# Altium schematic sheet OZ440-SE100-CAR003_sheet15.SchDoc
size A3
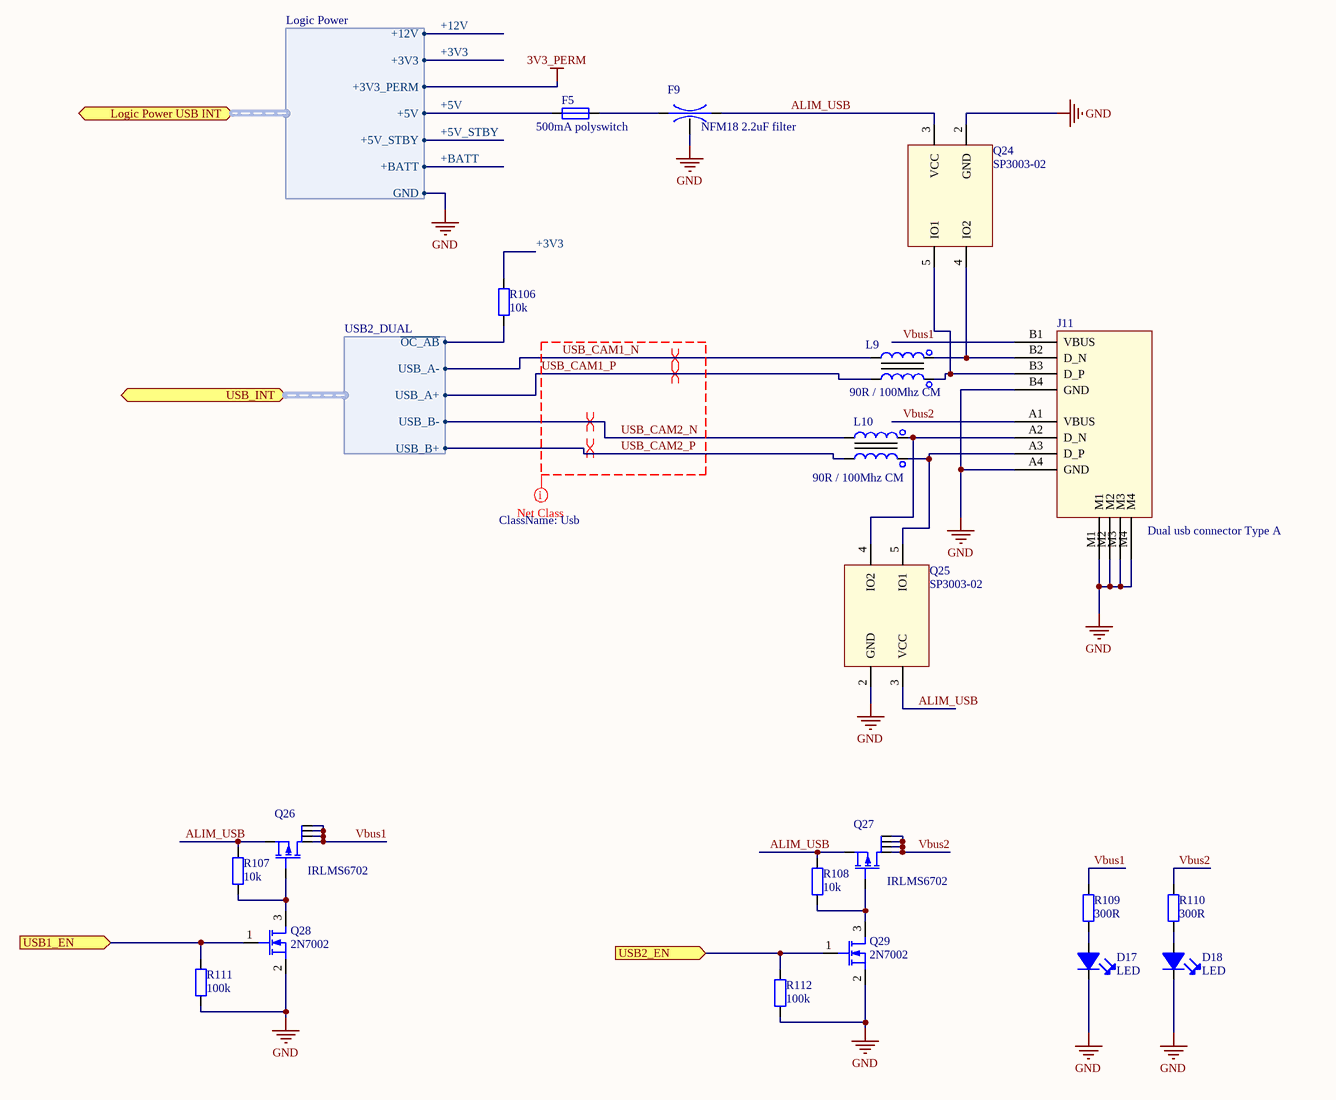
[diagram p0: OZ440-SE100-CAR003_sheet15.SchDoc]

## Parts
D17  LED  [0603-SPE-LED]
D18  LED  [0603-SPE-LED]
F5  Displayed reference: 500mA polyswitch  [R0805-STD]  (hidden comment: FUSE-SMD)
F9  Displayed reference: NFM18 2.2uF filter  [LC_0603-STD]  (hidden comment: LC_FILTER-STD)
J11  Displayed reference: Dual usb connector Type A  [CONN-STD-USB_A]  (hidden comment: CONN-STD_USB_A_DUAL)
L9  Displayed reference: 90R / 100Mhz CM  [L-SPE-0805_MC_EXC34]  (hidden comment: IND-MC-SMD)
L10  Displayed reference: 90R / 100Mhz CM  [L-SPE-0805_MC_EXC34]  (hidden comment: IND-MC-SMD)
Q24  Displayed reference: SP3003-02  [SC70-SPE-SP3003]  (hidden comment: SP03003_02-SC70)
Q25  Displayed reference: SP3003-02  [SC70-SPE-SP3003]  (hidden comment: SP03003_02-SC70)
Q26  Displayed reference: IRLMS6702  [MICRO6-SPE-IRLMS6702]  (hidden comment: IRLMS6702-MICRO6)
Q27  Displayed reference: IRLMS6702  [MICRO6-SPE-IRLMS6702]  (hidden comment: IRLMS6702-MICRO6)
Q28  Displayed reference: 2N7002  [SOT23-SPE-2N7002]  (hidden comment: 2N7002-SMD3P)
Q29  Displayed reference: 2N7002  [SOT23-SPE-2N7002]  (hidden comment: 2N7002-SMD3P)
R106  Displayed reference: 10k  [R0805-STD]  (hidden comment: RES-SMD)
R107  Displayed reference: 10k  [R0805-STD]  (hidden comment: RES-SMD)
R108  Displayed reference: 10k  [R0805-STD]  (hidden comment: RES-SMD)
R109  Displayed reference: 300R  [R0805-STD]  (hidden comment: RES-SMD)
R110  Displayed reference: 300R  [R0805-STD]  (hidden comment: RES-SMD)
R111  Displayed reference: 100k  [R0805-STD]  (hidden comment: RES-SMD)
R112  Displayed reference: 100k  [R0805-STD]  (hidden comment: RES-SMD)

## Ports
Logic Power USB INT (harness Logic Power), USB1_EN (in), USB2_EN (in), USB_INT (harness USB2_DUAL)

## Harnesses
USB2_DUAL: ~{OC_AB}, USB_A-, USB_A+, USB_B-, USB_B+
Logic Power: +12V, +3V3, +3V3_PERM, +5V, +5V_STBY, +BATT, GND

## Nets
3V3_PERM: port Logic Power USB INT.+3V3_PERM
GND: D17.2 D18.2 F9.3(G) J11.A4(GND) J11.B4(GND) J11.M1 J11.M2 J11.M3 J11.M4 Q24.2(GND) Q25.2(GND) Q28.2(S) Q29.2(S) R111.1 R112.1 ; port Logic Power USB INT.GND
+3V3: R106.2 ; port Logic Power USB INT.+3V3
+5V: F5.1 ; port Logic Power USB INT.+5V
+5V_STBY: port Logic Power USB INT.+5V_STBY
+12V: port Logic Power USB INT.+12V
+BATT: port Logic Power USB INT.+BATT
ALIM_USB: F9.2(B) Q24.3(VCC) Q25.3(VCC) Q26.4(S) Q27.4(S) R107.2 R108.2
USB1_EN: Q28.1(G) R111.2 ; port USB1_EN
USB2_EN: Q29.1(G) R112.2 ; port USB2_EN
USB_CAM1_N: L9.2 ; port USB_INT.USB_A-
USB_CAM1_P: L9.3 ; port USB_INT.USB_A+
USB_CAM2_N: L10.2 ; port USB_INT.USB_B-
USB_CAM2_P: L10.3 ; port USB_INT.USB_B+
Vbus1: J11.B1(VBUS) Q26.1(D) Q26.2(D) Q26.5(D) Q26.6(D) R109.2
Vbus2: J11.A1(VBUS) Q27.1(D) Q27.2(D) Q27.5(D) Q27.6(D) R110.2
NetD17_1: D17.1(A) R109.1
NetD18_1: D18.1(A) R110.1
NetF5_2: F5.2 F9.1(A)
NetJ11_A2: J11.A2(D_N) L10.1 Q25.4(IO2)
NetJ11_A3: J11.A3(D_P) L10.4 Q25.5(IO1)
NetJ11_B2: J11.B2(D_N) L9.1 Q24.4(IO2)
NetJ11_B3: J11.B3(D_P) L9.4 Q24.5(IO1)
NetQ26_3: Q26.3(G) Q28.3(D) R107.1
NetQ27_3: Q27.3(G) Q29.3(D) R108.1
NetR106_1: R106.1 ; port USB_INT.~{OC_AB}

## Layout directives
differential pair: USB_CAM1_N, USB_CAM1_P, USB_CAM2_N, USB_CAM2_P
net class Usb: USB_CAM1_N, USB_CAM1_P, USB_CAM2_N, USB_CAM2_P

## Notes on the sheet
- Titre document:
- NAIO TECHNOLOGIES
- 3 Av didier Daurat
- 31400 TOULOUSE
- Auteur:
- Numéro document:
- Verificateur:
- Format:
- A3
- Date:
- Revision:
- Page:
- /

## Library data of the parts
D17 D18 = KP-1608SGC: SMD Green LED 0603; Manufacturer: KingBright; Max Current: 20mA; Reference: KP-1608SGC; Displayed reference: LED; Footprint description: 0603; Pin Count: 2; helpURL: http://www.farnell.com/datasheets/55768.pdf; Supplier 1: Farnell; Supplier Part Number 1: 8529833; Supplier 2: Newark; Supplier Part Number 2: 38K3374
F5 = MF-PSMF050X-2: 0805 500mA resettable fuse; Manufacturer: BOURNS; Validated: False; Reference: MF-PSMF050X-2; Max Current: 500mA; Pin Count: 2; helpURL: http://www.farnell.com/datasheets/1442129.pdf; Supplier 1: Farnell; Supplier Part Number 1: 1294876; Supplier 2: Mouser; Supplier Part Number 2: 652-MF-PSMF050X-2
F9 = NFM18PC225B0J3: 2A LC filter; Manufacturer: MURATA; Max Voltage: 6.3; Frequency band: 0-20Mhz; Validated: False; Reference: NFM18PC225B0J3; Max Current: 2A; Footprint description: standard 0603 filter package; Pin Count: 3; Rev: 2/11/2011; helpURL: http://www.murata.com/products/emc/application/pdf/EMIAPDCE_2.pdf; Supplier 1: Digi-Key; Supplier Part Number 1: NFM18PC225B0J3D-ND; Supplier 2: Mouser; Supplier Part Number 2: 81-NFM18PC225B0J3D
J11 = 72309-8044BLF: Dual USB Type A connector; Manufacturer: FCI; Validated: False; Reference: 72309-8044BLF; Footprint description: Dual USB type A; Pin Count: 8; Rev: AJ; helpURL: http://portal.fciconnect.com/Comergent//fci/drawing/72309.pdf; Supplier 1: Mouser; Supplier Part Number 1: 649-72309-8044BLF; Supplier 2: Farnell; Supplier Part Number 2: 1835462
L9 L10 = EXC34CE900: USB common mode inductor; Manufacturer: PANASONIC; Max Current: 0.25A; Validated: False; Reference: EXC34CE900; Footprint description: SMD 4 pin; Pin Count: 4; Rev: 11/2012; helpURL: http://www.farnell.com/datasheets/1790924.pdf; Supplier 1: Farnell; Supplier Part Number 1: 1893883; Supplier 2: Mouser; Supplier Part Number 2: 667-EXC-34CE900U
Q24 Q25 = SP3003-02JTG: Low capacitance ESD TVS; Manufacturer: LITTLEFUSE; Max Voltage: 8V; Reference: SP3003-02JTG; component type: DIODE; Footprint description: SC70; Pin Count: 5; Rev: 20/08/13; helpURL: http://www.littelfuse.com/~/media/electronics/datasheets/tvs_diode_arrays/littelfuse_tvs_diode_array_sp3003_datasheet.pdf.pdf; Supplier 1: Farnell; Supplier Part Number 1: 2369568; Supplier 2: Mouser; Supplier Part Number 2: 576-SP3003-02JTG
Q26 Q27 = IRMLS6702TRPBF: 2A P channel MOSFET in MICRO6 package; Manufacturer: IRF; Max Voltage: 20V; Rated Power: 1.7W; Validated: False; Reference: IRMLS6702TRPBF; component type: PMOS; Max Current: 2A; Footprint description: MICRO6 SMD package; Pin Count: 6; Rev: 3/18/04; helpURL: http://www.irf.com/product-info/datasheets/data/irlms6702.pdf; Supplier 1: Farnell; Supplier Part Number 1: 1013479; Supplier 2: Digi-Key; Supplier Part Number 2: IRLMS6702PBFCT-ND
Q28 Q29 = 2N7002: N-Channel Enhancement Mode Field Effect Transistor; Manufacturer: FAIRCHILD; Max Voltage: 60 V; Max Current: 0,4 A; Rated Power: 0,2 W; Validated: False; Reference: 2N7002; component type: NMOS; Footprint description: SOT23; Pin Count: 3; Rev: A1; helpURL: http://www.fairchildsemi.com/ds/2N/2N7000.pdf; Supplier 1: Farnell; Supplier Part Number 1: 9845313; Supplier 2: Newark; Supplier Part Number 2: 58K9651
R106-R108 = CRCW080510K0FKxx: 10k Ohm 0805 SMD resistor; Manufacturer: Vishay; Value: 10 000; Tolerance: 1 %; Rated Power: 0,125 W; Validated: No; Reference: CRCW080510K0FKxx; Footprint description: standard 0805 SMD; Pin Count: 2; helpURL: http://www.vishay.com/docs/20035/dcrcwe3.pdf; Supplier 1: Farnell; Supplier Part Number 1: 1469856; Supplier 2: Mouser; Supplier Part Number 2: 71-CRCW0805-10K-E3
R109 R110 = CRCW0805300RFKxx: 300 ohm 0805 SMD resistor; Manufacturer: Vishay; Value: 300; Tolerance: 1%; Rated Power: 0.125W; Validated: No; Reference: CRCW0805300RFKxx; Footprint description: standard 0805 SMD; Pin Count: 2; helpURL: http://www.vishay.com/docs/20035/dcrcwe3.pdf; Supplier 1: Mouser; Supplier Part Number 1: 71-CRCW0805300RFKEA; Supplier 2: Farnell; Supplier Part Number 2: 1152346
R111 R112 = CRCW0805100KFKxx: 100k Ohm 0805 SMD resistor; Manufacturer: Vishay; Value: 100 000; Tolerance: 1 %; Rated Power: 0,125 W; Validated: No; Reference: CRCW0805100KFKxx; Footprint description: standard 0805 SMD; Pin Count: 2; helpURL: http://www.vishay.com/docs/20035/dcrcwe3.pdf; Supplier 1: Farnell; Supplier Part Number 1: 1469860; Supplier 2: Mouser; Supplier Part Number 2: 71-CRCW0805-100K-E3